# Altium schematic sheet Sheet1.SchDoc
size 420 x 297 mm; Scale: None
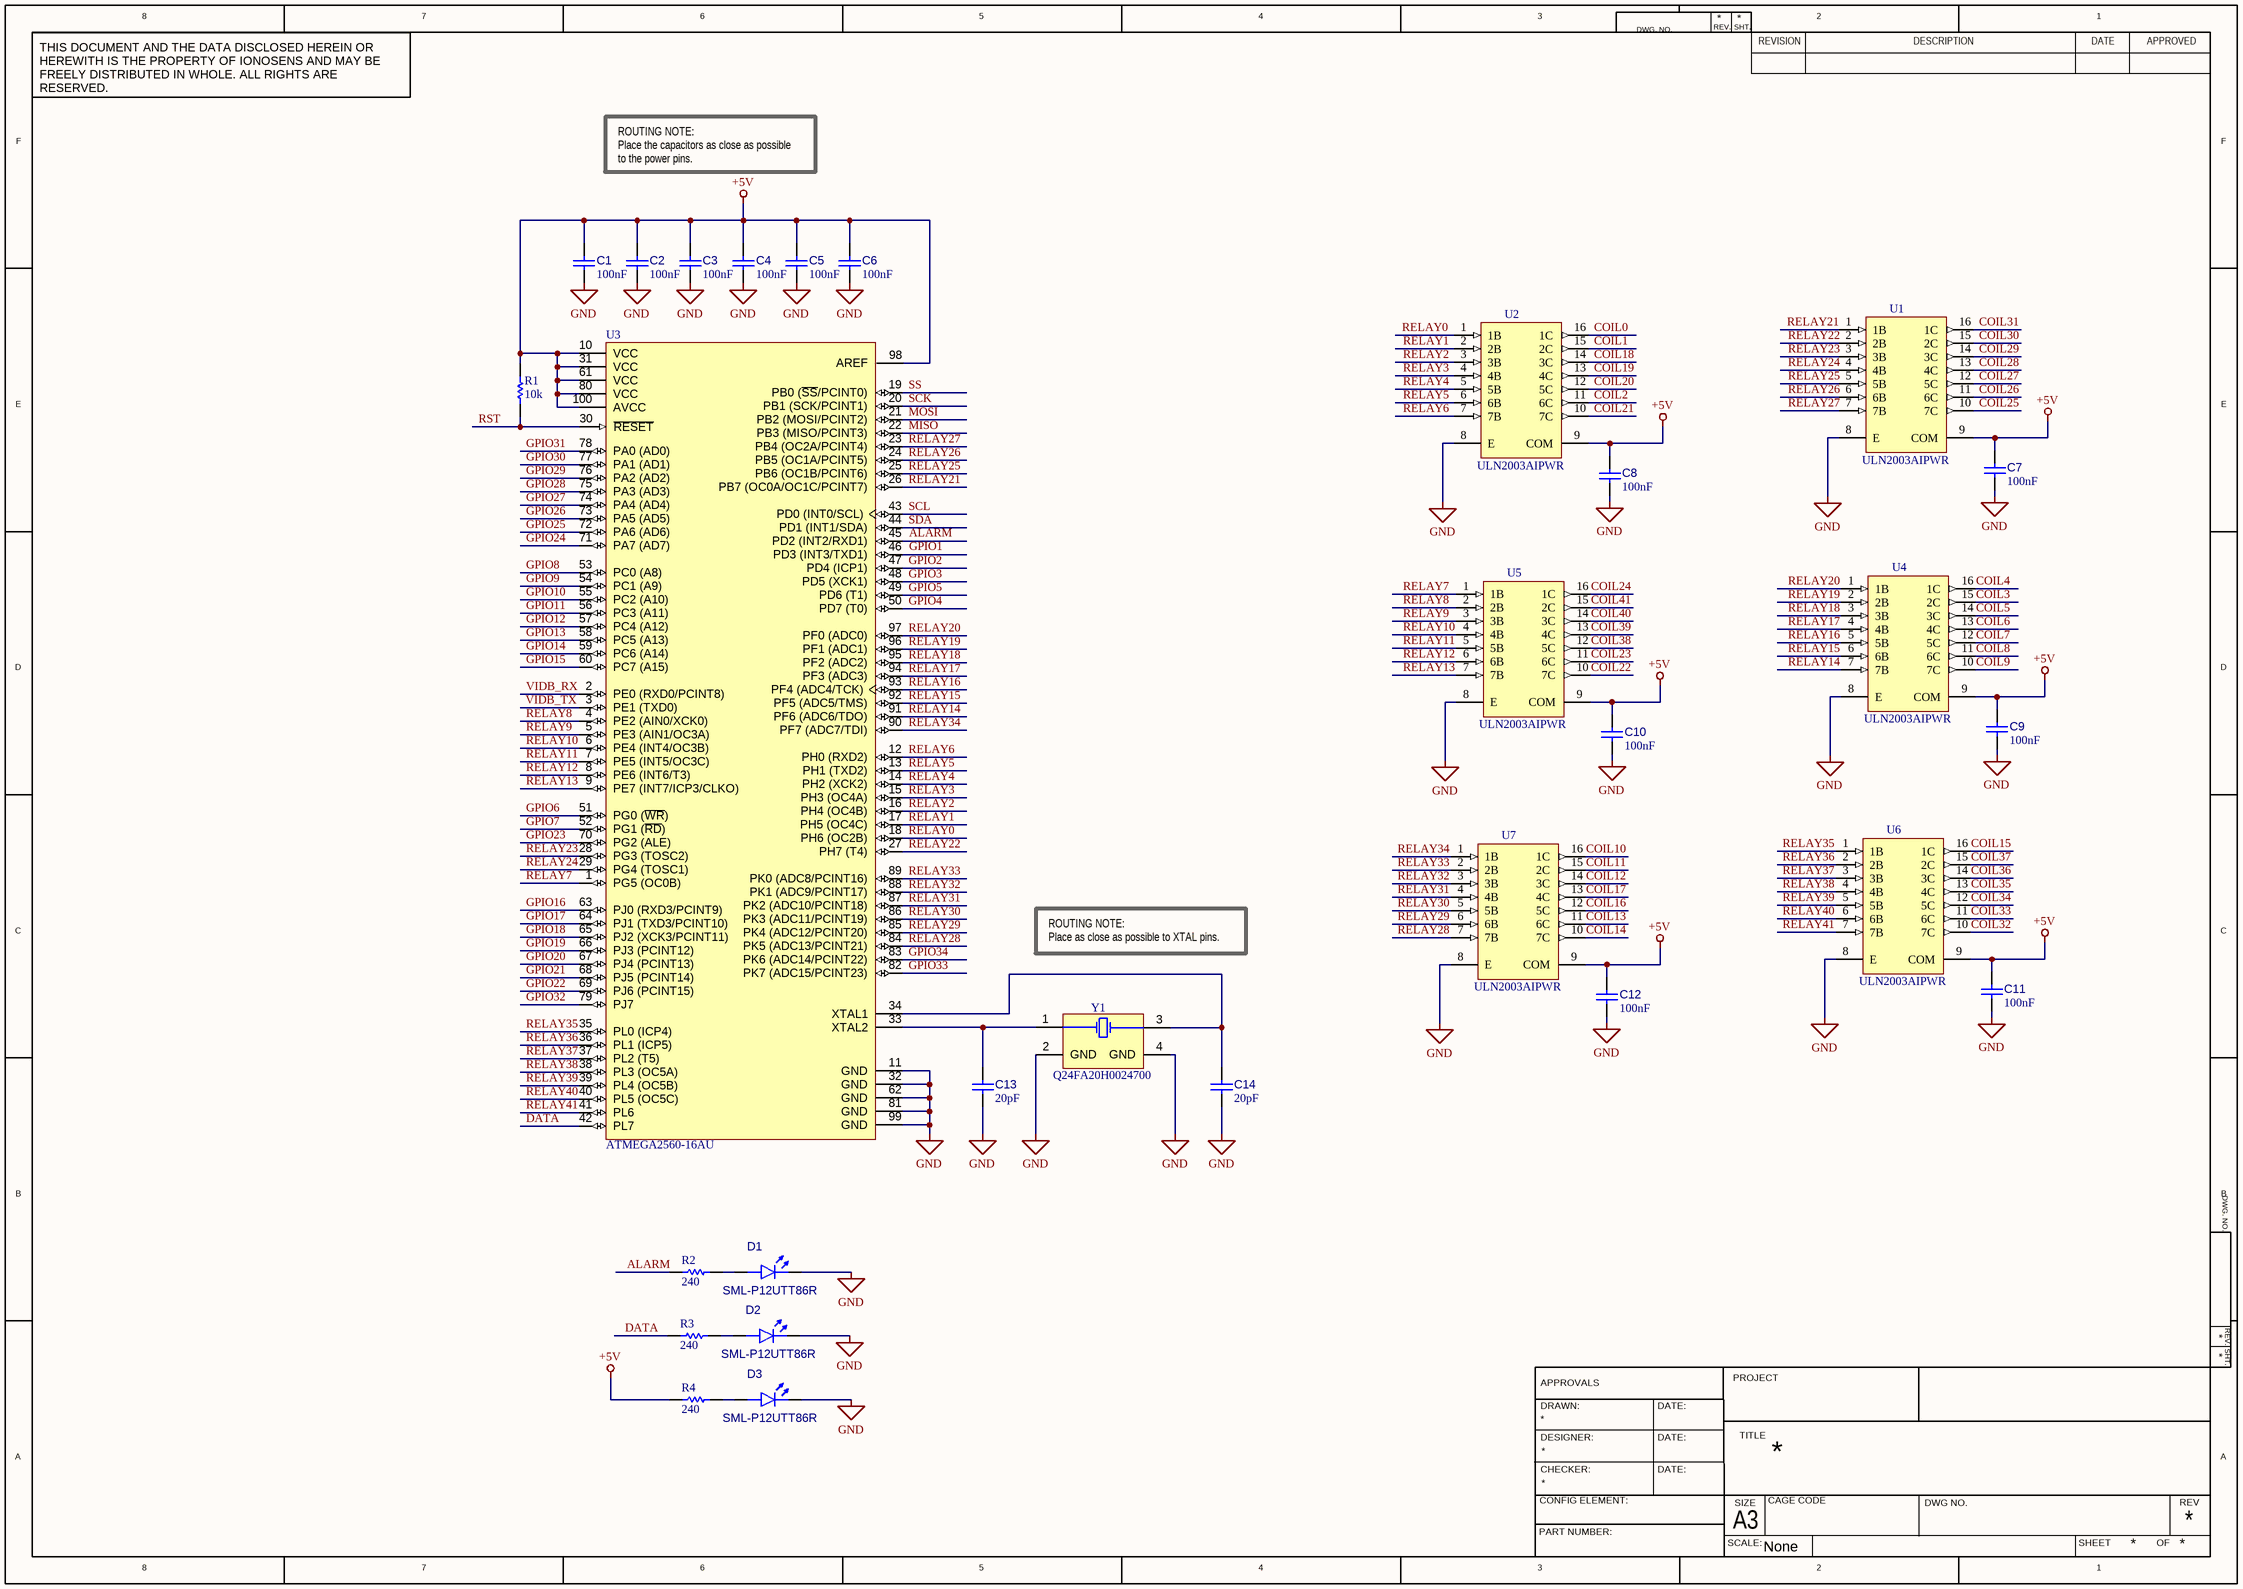
[diagram p0: Sheet1.SchDoc]

## Parts
C1  value 100nF  [CAPC1005X06M]  (hidden comment: CC0402JRX7R7BB104)
C2  value 100nF  [CAPC1005X06M]  (hidden comment: CC0402JRX7R7BB104)
C3  value 100nF  [CAPC1005X06M]  (hidden comment: CC0402JRX7R7BB104)
C4  value 100nF  [CAPC1005X06M]  (hidden comment: CC0402JRX7R7BB104)
C5  value 100nF  [CAPC1005X06M]  (hidden comment: CC0402JRX7R7BB104)
C6  value 100nF  [CAPC1005X06M]  (hidden comment: CC0402JRX7R7BB104)
C7  value 100nF  [CAPC1005X06M]  (hidden comment: CC0402JRX7R7BB104)
C8  value 100nF  [CAPC1005X06M]  (hidden comment: CC0402JRX7R7BB104)
C9  value 100nF  [CAPC1005X06M]  (hidden comment: CC0402JRX7R7BB104)
C10  value 100nF  [CAPC1005X06M]  (hidden comment: CC0402JRX7R7BB104)
C11  value 100nF  [CAPC1005X06M]  (hidden comment: CC0402JRX7R7BB104)
C12  value 100nF  [CAPC1005X06M]  (hidden comment: CC0402JRX7R7BB104)
C13  value 20pF  [CAPC1005X06M]  (hidden comment: CC0402JRNPO9BN200)
C14  value 20pF  [CAPC1005X06M]  (hidden comment: CC0402JRNPO9BN200)
D1  SML-P12UTT86R  [DIOC1005X02R]
D2  SML-P12UTT86R  [DIOC1005X02R]
D3  SML-P12UTT86R  [DIOC1005X02R]
R1  value 10k  [RESC1005X04M]  (hidden comment: AC0402FR-0710KL)
R2  value 240  [RESC1005X04M]  (hidden comment: AC0402FR-07240RL)
R3  value 240  [RESC1005X04M]  (hidden comment: AC0402FR-07240RL)
R4  value 240  [RESC1005X04M]  (hidden comment: AC0402FR-07240RL)
U1  ULN2003AIPWR  [TSOP65P640X120-16M]
U2  ULN2003AIPWR  [TSOP65P640X120-16M]
U3  ATMEGA2560-16AU  [ATML-100A_M]
U4  ULN2003AIPWR  [TSOP65P640X120-16M]
U5  ULN2003AIPWR  [TSOP65P640X120-16M]
U6  ULN2003AIPWR  [TSOP65P640X120-16M]
U7  ULN2003AIPWR  [TSOP65P640X120-16M]
Y1  Q24FA20H0024700  [FA-20H]

## Nets
+5V: C1.2 C2.2 C3.2 C4.2 C5.2 C6.2 C7.2 C8.2 C9.2 C10.2 C11.2 C12.2 R1.2 R4.1 U1.9(COM) U2.9(COM) U3.10(VCC) U3.31(VCC) U3.61(VCC) U3.80(VCC) U3.98(AREF) U3.100(AVCC) U4.9(COM) U5.9(COM) U6.9(COM) U7.9(COM)
GND: C1.1 C2.1 C3.1 C4.1 C5.1 C6.1 C7.1 C8.1 C9.1 C10.1 C11.1 C12.1 C13.1 C14.1 D1.1(K) D2.1(K) D3.1(K) U1.8(E) U2.8(E) U3.11(GND) U3.32(GND) U3.62(GND) U3.81(GND) U3.99(GND) U4.8(E) U5.8(E) U6.8(E) U7.8(E) Y1.2(GND) Y1.4(GND)
ALARM: R2.1 U3.45(PD2_(INT2/RXD1))
COIL0: U2.16(1C)
COIL1: U2.15(2C)
COIL2: U2.11(6C)
COIL3: U4.15(2C)
COIL4: U4.16(1C)
COIL5: U4.14(3C)
COIL6: U4.13(4C)
COIL7: U4.12(5C)
COIL8: U4.11(6C)
COIL9: U4.10(7C)
COIL10: U7.16(1C)
COIL11: U7.15(2C)
COIL12: U7.14(3C)
COIL13: U7.11(6C)
COIL14: U7.10(7C)
COIL15: U6.16(1C)
COIL16: U7.12(5C)
COIL17: U7.13(4C)
COIL18: U2.14(3C)
COIL19: U2.13(4C)
COIL20: U2.12(5C)
COIL21: U2.10(7C)
COIL22: U5.10(7C)
COIL23: U5.11(6C)
COIL24: U5.16(1C)
COIL25: U1.10(7C)
COIL26: U1.11(6C)
COIL27: U1.12(5C)
COIL28: U1.13(4C)
COIL29: U1.14(3C)
COIL30: U1.15(2C)
COIL31: U1.16(1C)
COIL32: U6.10(7C)
COIL33: U6.11(6C)
COIL34: U6.12(5C)
COIL35: U6.13(4C)
COIL36: U6.14(3C)
COIL37: U6.15(2C)
COIL38: U5.12(5C)
COIL39: U5.13(4C)
COIL40: U5.14(3C)
COIL41: U5.15(2C)
DATA: R3.1 U3.42(PL7)
GPIO1: U3.46(PD3_(INT3/TXD1))
GPIO2: U3.47(PD4_(ICP1))
GPIO3: U3.48(PD5_(XCK1))
GPIO4: U3.50(PD7_(T0))
GPIO5: U3.49(PD6_(T1))
GPIO6: U3.51(PG0_(~{WR}))
GPIO7: U3.52(PG1_(~{RD}))
GPIO8: U3.53(PC0_(A8))
GPIO9: U3.54(PC1_(A9))
GPIO10: U3.55(PC2_(A10))
GPIO11: U3.56(PC3_(A11))
GPIO12: U3.57(PC4_(A12))
GPIO13: U3.58(PC5_(A13))
GPIO14: U3.59(PC6_(A14))
GPIO15: U3.60(PC7_(A15))
GPIO16: U3.63(PJ0_(RXD3/PCINT9))
GPIO17: U3.64(PJ1_(TXD3/PCINT10))
GPIO18: U3.65(PJ2_(XCK3/PCINT11))
GPIO19: U3.66(PJ3_(PCINT12))
GPIO20: U3.67(PJ4_(PCINT13))
GPIO21: U3.68(PJ5_(PCINT14))
GPIO22: U3.69(PJ6_(PCINT15))
GPIO23: U3.70(PG2_(ALE))
GPIO24: U3.71(PA7_(AD7))
GPIO25: U3.72(PA6_(AD6))
GPIO26: U3.73(PA5_(AD5))
GPIO27: U3.74(PA4_(AD4))
GPIO28: U3.75(PA3_(AD3))
GPIO29: U3.76(PA2_(AD2))
GPIO30: U3.77(PA1_(AD1))
GPIO31: U3.78(PA0_(AD0))
GPIO32: U3.79(PJ7)
GPIO33: U3.82(PK7_(ADC15/PCINT23))
GPIO34: U3.83(PK6_(ADC14/PCINT22))
MISO: U3.22(PB3_(MISO/PCINT3))
MOSI: U3.21(PB2_(MOSI/PCINT2))
RELAY0: U2.1(1B) U3.18(PH6_(OC2B))
RELAY1: U2.2(2B) U3.17(PH5_(OC4C))
RELAY2: U2.3(3B) U3.16(PH4_(OC4B))
RELAY3: U2.4(4B) U3.15(PH3_(OC4A))
RELAY4: U2.5(5B) U3.14(PH2_(XCK2))
RELAY5: U2.6(6B) U3.13(PH1_(TXD2))
RELAY6: U2.7(7B) U3.12(PH0_(RXD2))
RELAY7: U3.1(PG5_(OC0B)) U5.1(1B)
RELAY8: U3.4(PE2_(AIN0/XCK0)) U5.2(2B)
RELAY9: U3.5(PE3_(AIN1/OC3A)) U5.3(3B)
RELAY10: U3.6(PE4_(INT4/OC3B)) U5.4(4B)
RELAY11: U3.7(PE5_(INT5/OC3C)) U5.5(5B)
RELAY12: U3.8(PE6_(INT6/T3)) U5.6(6B)
RELAY13: U3.9(PE7_(INT7/ICP3/CLKO)) U5.7(7B)
RELAY14: U3.91(PF6_(ADC6/TDO)) U4.7(7B)
RELAY15: U3.92(PF5_(ADC5/TMS)) U4.6(6B)
RELAY16: U3.93(PF4_(ADC4/TCK)) U4.5(5B)
RELAY17: U3.94(PF3_(ADC3)) U4.4(4B)
RELAY18: U3.95(PF2_(ADC2)) U4.3(3B)
RELAY19: U3.96(PF1_(ADC1)) U4.2(2B)
RELAY20: U3.97(PF0_(ADC0)) U4.1(1B)
RELAY21: U1.1(1B) U3.26(PB7_(OC0A/OC1C/PCINT7))
RELAY22: U1.2(2B) U3.27(PH7_(T4))
RELAY23: U1.3(3B) U3.28(PG3_(TOSC2))
RELAY24: U1.4(4B) U3.29(PG4_(TOSC1))
RELAY25: U1.5(5B) U3.25(PB6_(OC1B/PCINT6))
RELAY26: U1.6(6B) U3.24(PB5_(OC1A/PCINT5))
RELAY27: U1.7(7B) U3.23(PB4_(OC2A/PCINT4))
RELAY28: U3.84(PK5_(ADC13/PCINT21)) U7.7(7B)
RELAY29: U3.85(PK4_(ADC12/PCINT20)) U7.6(6B)
RELAY30: U3.86(PK3_(ADC11/PCINT19)) U7.5(5B)
RELAY31: U3.87(PK2_(ADC10/PCINT18)) U7.4(4B)
RELAY32: U3.88(PK1_(ADC9/PCINT17)) U7.3(3B)
RELAY33: U3.89(PK0_(ADC8/PCINT16)) U7.2(2B)
RELAY34: U3.90(PF7_(ADC7/TDI)) U7.1(1B)
RELAY35: U3.35(PL0_(ICP4)) U6.1(1B)
RELAY36: U3.36(PL1_(ICP5)) U6.2(2B)
RELAY37: U3.37(PL2_(T5)) U6.3(3B)
RELAY38: U3.38(PL3_(OC5A)) U6.4(4B)
RELAY39: U3.39(PL4_(OC5B)) U6.5(5B)
RELAY40: U3.40(PL5_(OC5C)) U6.6(6B)
RELAY41: U3.41(PL6) U6.7(7B)
RST: R1.1 U3.30(~{RESET})
SCK: U3.20(PB1_(SCK/PCINT1))
SCL: U3.43(PD0_(INT0/SCL))
SDA: U3.44(PD1_(INT1/SDA))
SS: U3.19(PB0_(~{SS}/PCINT0))
VIDB_RX: U3.2(PE0_(RXD0/PCINT8))
VIDB_TX: U3.3(PE1_(TXD0))
NetC13_2: C13.2 U3.33(XTAL2) Y1.1(X1)
NetC14_2: C14.2 U3.34(XTAL1) Y1.3(X2)
NetD1_2: D1.2(A) R2.2
NetD2_2: D2.2(A) R3.2
NetD3_2: D3.2(A) R4.2

## Notes on the sheet
- ROUTING NOTE:
  Place the capacitors as close as possible to the power pins.
- ROUTING NOTE:
  Place as close as possible to XTAL pins.
- 8
- 7
- 6
- 5
- 4
- 3
- DWG. NO.
- REV.
- SHT.
- REVISION
- 2
- DESCRIPTION
- DATE
- 1
- APPROVED
- THIS DOCUMENT AND THE DATA DISCLOSED HEREIN OR HEREWITH IS THE PROPERTY OF IONOSENS AND MAY BE FREELY DISTRIBUTED IN WHOLE. ALL RIGHTS ARE RESERVED.
- F
- E
- D
- C
- B
- DRAWN:
- APPROVALS
- DATE:
- PROJECT
- A
- CHECKER:
- DESIGNER:
- TITLE
- PART NUMBER:
- CONFIG ELEMENT:
- SCALE:
- A3
- SIZE
- CAGE CODE
- DWG NO.
- SHEET
- OF
- REV

## Library data of the parts
C1-C12 = C01-0402-01-00001-1: Cap Ceramic 100nF 50V X7R 5% SMD 0402 125°C; Manufacturer: YAGEO; Voltage Rating: 16V; Case/Package: 0402; Capacitor Type: Ceramic; Min Operating Temperature: -55°C; Width: 508µm; Length: 1mm; Tolerance: 5%; Dielectric: X7R; RoHS Compliant: Yes; Pins: 2; Composition: Ceramic; Depth: 500µm; Voltage Rating (DC): 16V; Mount: Surface Mount; Mounting Technology: Surface Mount; Termination: SMD/SMT; Manufacturer P/N: CC0402JRX7R7BB104; Thickness: 558.8µm; Max Operating Temperature: 125°C
C13 C14 = C01-0402-01-00008-1: Cap Ceramic 20pF 50V C0G 5% SMD 0402 125°C; Manufacturer: YAGEO; Dielectric: COG; Case/Package: 0402; Tolerance: 5%; Thickness: 558.8µm; Termination: SMD/SMT; Manufacturer P/N: CC0402JRNPO9BN200; Voltage Rating: 50V; Length: 990.6µm; Depth: 500µm; Width: 508µm; Min Operating Temperature: -55°C; Mount: Surface Mount; Voltage Rating (DC): 50V; Pins: 2; Capacitor Type: Ceramic; RoHS Compliant: Yes; Composition: Ceramic; Mounting Technology: Surface Mount; Max Operating Temperature: 125°C
D1-D3 = D01-0402-01-00001-1: Led red 0402; Manufacturer: ROHM; Number of LEDs: 1; Max Power Dissipation: 52mW; Luminous Intensity: 85 mcd; Dominant Wavelength: 620 nm; Lens Style: Rectangular, Square; Forward Current: 20 mA; Forward Voltage: 2V; Mounting Technology: SMD; Case/Package: 0402; Min Operating Temperature: -40°C; Max Operating Temperature: 85°C; Manufacturer P/N: SML-P12UTT86R; Colour: red; RoHS Compliant: Yes; Pins: 2
R1 = R01-0402-01-00169-2: RES SMD 10K OHM 1% 1/16W 0402; Manufacturer: Yageo; Temperature Coefficient: 100 ppm/ºC; Power Rating: 62.5mW; Voltage Rating: 50V; Length: 990.6µm; Height: 370µm; Min Operating Temperature: -55°C; Case/Package: 0402; Features: Automotive AEC-Q200, Moisture Resistant; Packaging: Tape & Reel; Width: 508µm; Manufacturer P/N: AC0402FR-0710KL; RoHS: Yes; Max Operating Temperature: 155°C; Tolerance: 1%; Composition: Thick Film; Number of Terminations: 2
R2-R4 = R01-0402-01-00437-2: RES SMD 240 OHM 1% 1/16W 0402; Manufacturer: Yageo; Temperature Coefficient: 100 ppm/ºC; Power Rating: 62.5mW; Voltage Rating: 50V; Packaging: Tape & Reel; Manufacturer P/N: AC0402FR-07240RL; Height: 370µm; Case/Package: 0402; Composition: Thick Film; Max Operating Temperature: 155°C; Number of Terminations: 2; RoHS: Yes; Min Operating Temperature: -55°C; Tolerance: 1%; Width: 508µm; Length: 990.6µm; Features: Automotive AEC-Q200, Moisture Resistant
U1 U2 U4-U7 = CMP-0005-0001-00001-1: 50-V, 7-ch darlington transistor array, -40 to 105C 16-TSSOP -40 to 105; Manufacturer: Texas Instruments; Voltage Rating: 50V; Min Operating Temperature: 105°C; RoHS Compliant: yes; Pins: 16; Case/Package: TSSOP; Mounting Technology: SMD; Length: 5mm; Manufacturer P/N: ULN2003AIPWR; Height: 1.2mm; Max Operating Temperature: -40°C; Width: 4.4mm
U3 = U01-0007-01-00000-1: AVR ATmega Microcontroller 8-bit 16MHz 256KB FLASH TQFP100; Manufacturer: Microchip; Oscillator Type: External; Interface: I2C, SPI, UART; Minimum Supply Voltage: 4.5V; Peripherals: Brown-out Detect/Reset, POR, PWM, WDT; Number of A/D: 1 AD / 16 channels; Watchdog Timer: Yes; Number of I/O: 86; RAM Size: 8KB; Max Supply Voltage: 5.5V; Max Operating Temperature: 85°C; Manufacturer P/N: ATMEGA2560-16AU; Memory Size: 256KB; Mounting Technology: SMD; Memory Type: FLASH; Pins: 100; Height: 1.2mm; Case/Package: A; RoHS: Yes; Min Operating Temperature: -40°C; Max Frequency: 16MHz; Number of Programmable I/O: 86; Contact Plating: Tin; Core Architecture: AVR; Frequency: 16MHz; Width: 16.25mm
Y1 = Y01-0001-01-00000-11: 16MHz ±10ppm 16pF 80Ω SMD-2520_4P; Manufacturer: SEIKO-EPSON; ESR: 80; RoHS Compliant: yes; Min Operating Temperature: -40°C; Load Capacitance: 16pF; Mounting Technology: SMD; Pins: 4; Case/Package: SMD-2520_4P; Max Operating Temperature: 85°C; Frequency: 16MHz; Manufacturer P/N: Q24FA20H0024700